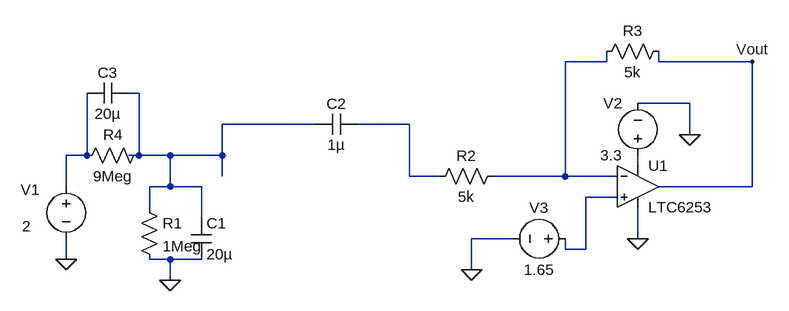
[diagram p0: schematic FrontEndSimulation.asc]
FrontEndSimulation.asc, the LTspice schematic file:
Version 4.1
SHEET 1 1196 680
WIRE 928 -96 928 -112
WIRE 928 -96 864 -96
WIRE 1008 -96 1008 -112
WIRE 1152 -96 1008 -96
WIRE 208 -48 192 -48
WIRE 1056 -32 976 -32
WIRE 480 0 336 0
WIRE 624 0 544 0
WIRE 1056 16 1056 -32
WIRE 128 48 128 -48
WIRE 128 48 96 48
WIRE 208 48 208 -48
WIRE 208 48 192 48
WIRE 256 48 208 48
WIRE 336 48 336 0
WIRE 336 48 256 48
WIRE 976 64 976 48
WIRE 336 80 336 48
WIRE 624 80 624 0
WIRE 672 80 624 80
WIRE 864 80 864 -96
WIRE 864 80 752 80
WIRE 944 80 864 80
WIRE 96 96 96 48
WIRE 256 96 256 48
WIRE 256 96 224 96
WIRE 304 96 256 96
WIRE 1152 96 1152 -96
WIRE 1152 96 1008 96
WIRE 944 112 896 112
WIRE 224 128 224 96
WIRE 304 144 304 96
WIRE 784 176 720 176
WIRE 976 176 976 128
WIRE 864 192 864 176
WIRE 896 192 896 112
WIRE 896 192 864 192
WIRE 96 208 96 176
WIRE 256 208 224 208
WIRE 304 208 256 208
WIRE 720 224 720 176
WIRE 256 240 256 208
FLAG 96 208 0
FLAG 256 240 0
FLAG 720 224 0
FLAG 976 176 0
FLAG 1056 16 0
FLAG 1152 -96 Vout
SYMBOL voltage 96 80 R0
WINDOW 0 -70 21 Left 2
WINDOW 3 -68 77 Left 2
SYMATTR InstName V1
SYMATTR Value 2
SYMBOL cap 288 144 R0
SYMATTR InstName C1
SYMATTR Value 20µ
SYMBOL res 208 112 R0
SYMATTR InstName R1
SYMATTR Value 1Meg
SYMBOL cap 544 -16 R90
WINDOW 0 0 32 VBottom 2
WINDOW 3 32 32 VTop 2
SYMATTR InstName C2
SYMATTR Value 1µ
SYMBOL res 768 64 R90
WINDOW 0 0 56 VBottom 2
WINDOW 3 32 56 VTop 2
SYMATTR InstName R2
SYMATTR Value 5k
SYMBOL voltage 976 64 R180
WINDOW 0 24 96 Left 2
WINDOW 3 24 16 Left 2
SYMATTR InstName V2
SYMATTR Value 3.3
SYMBOL voltage 880 176 R90
WINDOW 0 -32 56 VBottom 2
WINDOW 3 32 56 VTop 2
SYMATTR InstName V3
SYMATTR Value 1.65
SYMBOL OpAmps\\LTC6253 976 96 R0
SYMATTR InstName U1
SYMBOL res 1024 -128 R90
WINDOW 0 0 56 VBottom 2
WINDOW 3 32 56 VTop 2
SYMATTR InstName R3
SYMATTR Value 5k
SYMBOL res 224 32 R90
WINDOW 0 0 56 VBottom 2
WINDOW 3 32 56 VTop 2
SYMATTR InstName R4
SYMATTR Value 9Meg
SYMBOL cap 192 -64 R90
WINDOW 0 0 32 VBottom 2
WINDOW 3 32 32 VTop 2
SYMATTR InstName C3
SYMATTR Value 20µ

The netlist it stands for:
* FrontEndSimulation.asc
V1 N004 0 2
C1 N002 0 20µ
R1 N002 0 1Meg
C2 N003 N002 1µ
R2 N001 N003 5k
V2 N005 0 3.3
V3 N006 0 1.65
* U1: LTC6253 (symbol OpAmps\LTC6253 not available, pins judged from their places): In+=N006 In-=N001 V+=N005 V-=0 OUT=Vout
R3 Vout N001 5k
R4 N002 N004 9Meg
C3 N002 N004 20µ
.backanno
.end